# EAGLE design D1 Breakout - LCD TH Screws (EAGLE 7.3.0)
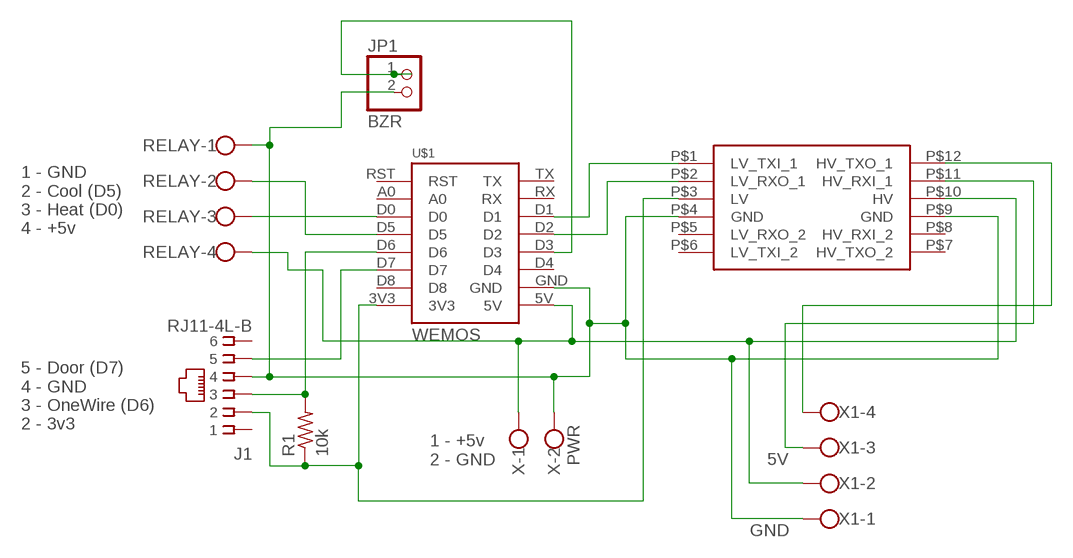
[diagram p0: schematic, sheet 1]

## Parts
J1  RJ11-4L-B  [RJ11-NO_SHIELD]
JP1  BZR  PINHD-1X2  [1X02]
R1  10k  R-US_0207/5V  [0207/5V]
RELAY  W237-4  [W237-4]
U$1  WEMOS  [WEMOS]
U$3  LOGIC_LEVEL_CONVERTER  [LOGIC_LEVEL_CONVERTER]
X  PWR  W237-102  [W237-102]
X1  W237-4  [W237-4]

## Nets
5V [5v]: RELAY.4 U$1.5V U$3.P$10(HV) X1.2 X.1
D0: RELAY.3 U$1.D0
D5: RELAY.2 U$1.D5
D6: J1.3 R1.2 U$1.D6
D7: J1.5 U$1.D7
GND [Gnd]: J1.4 JP1.2 RELAY.1 U$1.GND U$3.P$4(GND) U$3.P$9(GND) X1.1 X.2
N$1: U$1.D1 U$3.P$1(LV_TXI_1)
N$2: U$1.D2 U$3.P$2(LV_RXO_1)
N$3 [3v]: J1.2 R1.1 U$1.3V3 U$3.P$3(LV)
N$4: U$3.P$12(HV_TXO_1) X1.4
N$5: U$3.P$11(HV_RXI_1) X1.3
N$6: JP1.1 U$1.D3
Unconnected: J1.1 J1.6 U$1.A0 U$1.D4 U$1.D8 U$1.RST U$1.RX U$1.TX U$3.P$5(LV_RXO_2) U$3.P$6(LV_TXI_2) U$3.P$7(HV_TXO_2) U$3.P$8(HV_RXI_2)

## Notes on the sheet
- 1 - GND
  2 - Cool (D5)
  3 - Heat (D0)
  4 - +5v
- 5 - Door (D7)
  4 - GND
  3 - OneWire (D6) 
  2 - 3v3
- 1 - +5v
  2 - GND

## Library data of the parts
J1 = con-tycoelectronics:RJ11: CORCOM Modular RJ Jacks No Shield Source: www.tycoelectronics.com .. ENG_DS_1654001_1099_RJ_L_0507.pdf; MF: TYCO ELECTRONICS; MPN: RJ11-4L-B; OC_FARNELL: unknown; OC_NEWARK: 52K3315
JP1 = pinhead:PINHD-1X2: PIN HEADER
R1 = rcl:R-US_: RESISTOR, American symbol
RELAY X1 = con-wago-500:W237-4: WAGO SCREW CLAMP; OC_FARNELL: unknown; OC_NEWARK: unknown
U$1 = 1455413453956-wemos:WEMOS
U$3 = SparkFun-Boards:LOGIC_LEVEL_CONVERTER: Logic Level Converter (3.3v - 5v) https://www.sparkfun.com/products/8745
X = con-wago-500:W237-102: WAGO SCREW CLAMP; MPN: 237-102; OC_FARNELL: unknown; OC_NEWARK: 70K9898

## Net classes
0 default: width 0.305 mm, clearance 0.305 mm
1 5v: width 0.406 mm, clearance 0.406 mm
2 3v: width 0.406 mm, clearance 0.406 mm
3 Gnd: width 0.406 mm, clearance 0.406 mm

## Board
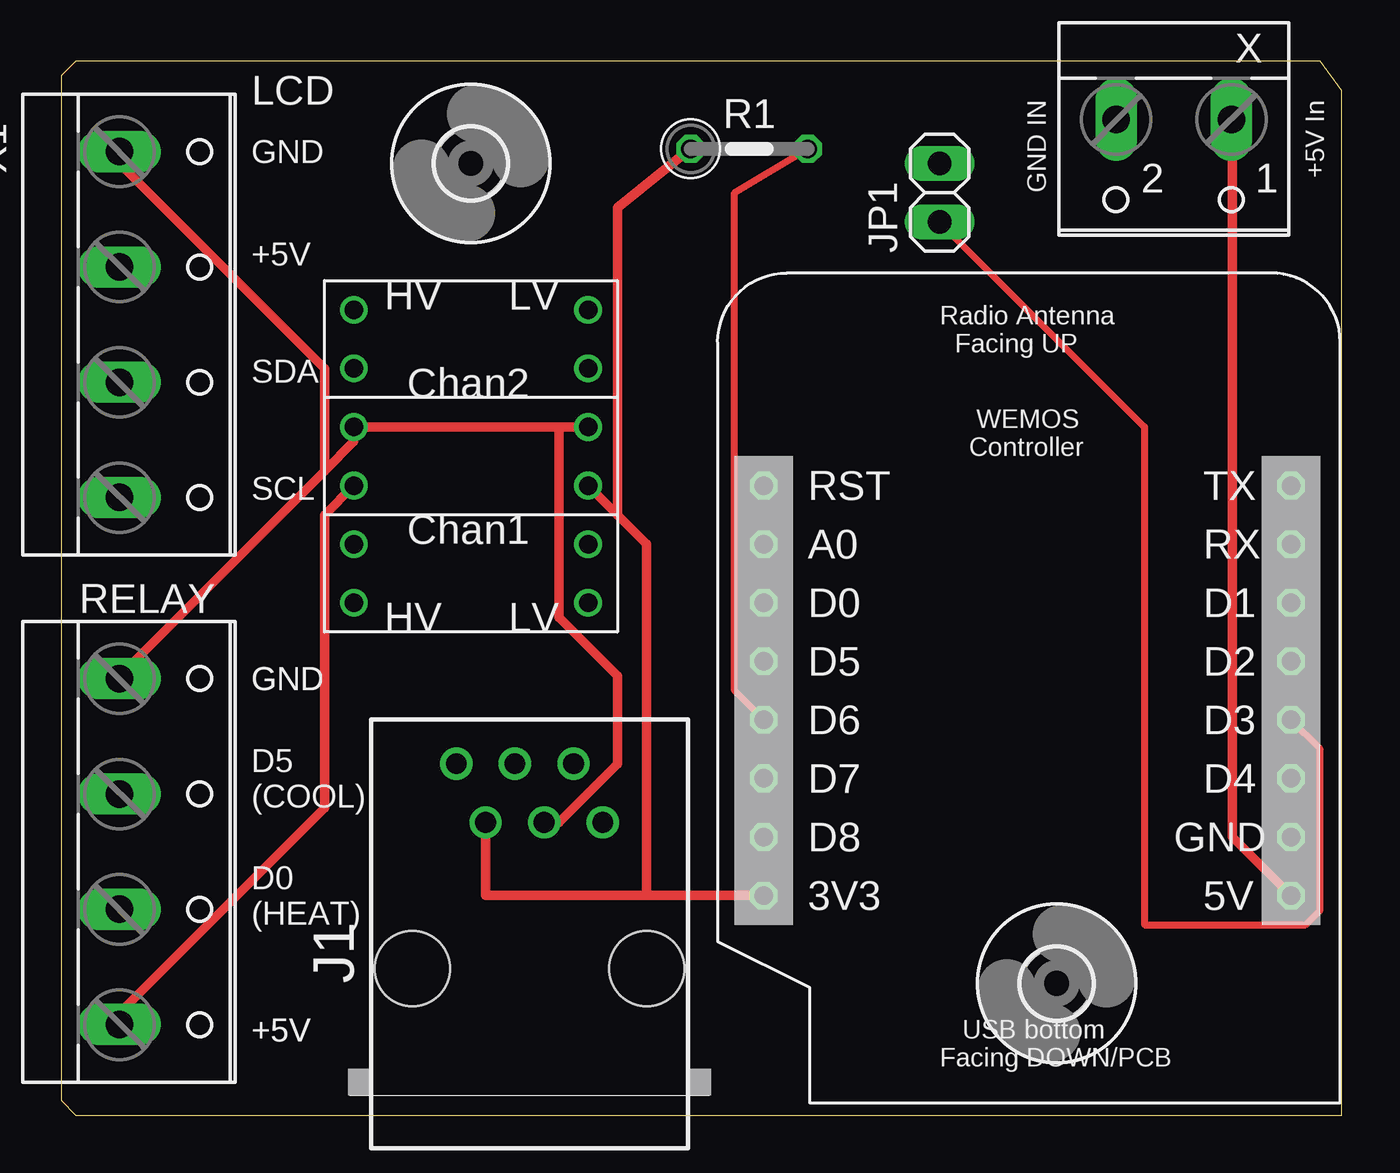
[diagram p1: board, top side]
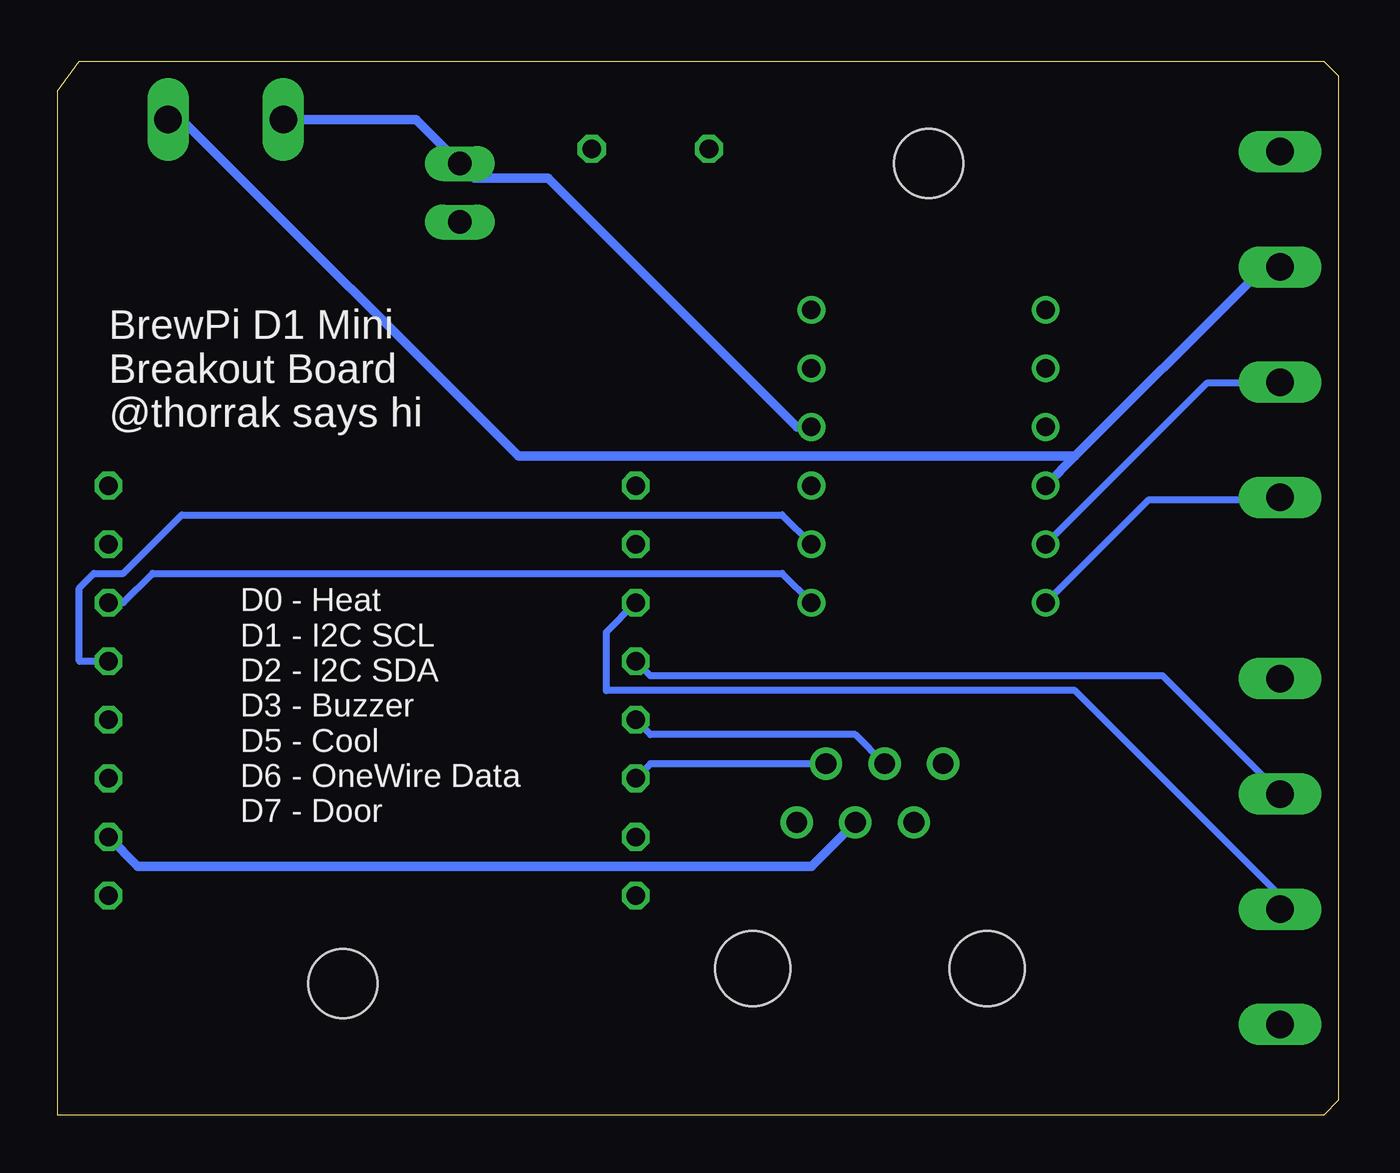
[diagram p2: board, bottom side, seen from below]

Size 55.55 x 45.72 mm. Coordinates in mm from the lower left corner, seen from the top.
Outline: 0,0.64 0.63,0 55.55,0 55.55,44.44 54.61,45.71 53.34,45.72 0.63,45.72 0,45.08 0,0.64
Copper layers (1*16): Top 0.0356mm / dielectric 1.5011mm / Bottom 0.0356mm
Design rules "PCBs_io": minimum track width 6mil, minimum drill 13mil, track to track 6mil, track to pad 6mil, pad to pad 6mil, via to via 6mil, smd to smd 6mil, copper to edge 15mil, drill to drill 6mil, minimum pad ring 7mil, minimum via ring 7mil, stop-mask expansion 3mil, vias tented up to drill 0mil, thermal gap 10mil

### Footprints (pad centres in the part's own frame; a part is rotated, then mirrored left to right if it is on the bottom)
RJ11-NO_SHIELD = drill 0.9 pad 1.4: 1 -3.175,8.89; 2 -1.905,6.35; 3 -0.635,8.89; 4 0.635,6.35; 5 1.905,8.89; 6 3.175,6.35 | hole 3.251: -5.08,0; 5.08,0
1X02 = drill 1.016 long: 1 -1.27,0; 2 1.27,0
0207/5V = drill 0.813 octagon: 1 -2.54,0; 2 2.54,0
W237-4 = drill 1.194 long: 1 -7.5,-1.27; 2 -2.5,-1.27; 3 2.5,-1.27; 4 7.5,-1.27
WEMOS = drill 0.8 octagon: 3V3 0,0; 5V 22.86,0; A0 0,15.24; D0 0,12.7; D1 22.86,12.7; D2 22.86,10.16; D3 22.86,7.62; D4 22.86,5.08; D5 0,10.16; D6 0,7.62; D7 0,5.08; D8 0,2.54; GND 22.86,2.54; RST 0,17.78; RX 22.86,15.24; TX 22.86,17.78
3,0 = hole 3: 0,0
LOGIC_LEVEL_CONVERTER = drill 0.8: P$1 1.27,13.97; P$2 1.27,11.43; P$3 1.27,8.89; P$4 1.27,6.35; P$5 1.27,3.81; P$6 1.27,1.27; P$7 11.43,1.27; P$8 11.43,3.81; P$9 11.43,6.35; P$10 11.43,8.89; P$11 11.43,11.43; P$12 11.43,13.97
W237-102 = drill 1.194 long: 1 -2.5,-1.27; 2 2.5,-1.27

### Placement (x,y rotation side)
J1  20.32,6.35 0 top
JP1  38.1,40 90 top
R1  29.84,41.91 0 top
RELAY  3.81,11.43 270 top
U$1  30.48,9.53 0 top
U$2  [3,0]  17.78,41.27 0 top
U$3  24.13,36.19 180 top
U$4  [3,0]  43.18,5.71 0 top
X  48.26,41.91 180 top
X1  3.81,34.29 270 top

### Tracks (layer width: path | path; a pad name or v marks a point on that pad's centre or on a via)
5V
  Top 0.406: U$1.5V 50.8,12.07 50.8,43.18 X.1 | U$3.P$10 11.43,26.04 11.43,13.33 2.54,4.45 RELAY.4
  Bottom 0.406: 11.43,28.57 3.81,36.19 2.54,36.19 X1.2 | 11.43,28.57 U$3.P$10 | 11.43,28.57 35.56,28.57 50.17,43.18 X.1
D0
  Bottom 0.305: U$1.D0 31.75,20.96 31.75,18.42 11.43,18.42 2.54,9.53 RELAY.3
D5
  Bottom 0.305: U$1.D5 29.84,19.05 7.62,19.05 2.54,13.97 RELAY.2
D6
  Top 0.305: R1.2 29.21,40 29.21,18.42 U$1.D6
  Bottom 0.305: U$1.D6 29.84,16.51 20.96,16.51 J1.3
D7
  Bottom 0.305: U$1.D7 29.84,15.24 J1.5
GND
  Top 0.406: U$3.P$4 21.59,29.85 | 21.59,29.85 U$3.P$9 12.7,29.21 11.43,27.94 | 11.43,27.94 2.54,19.05 RELAY.1 | 11.43,27.94 11.43,32.39 2.54,41.27 X1.1 | J1.4 21.59,12.7 24.13,15.24 24.13,19.05 21.59,21.59 21.59,29.85
  Bottom 0.406: U$1.GND 52.07,10.79 22.86,10.79 J1.4 | X.2 40,43.18 JP1.2 37.47,40.64 34.29,40.64 23.5,29.85 U$3.P$4
N$1
  Bottom 0.305: U$3.P$1 24.13,23.5 51.44,23.5 52.7,22.22 U$1.D1
N$2
  Bottom 0.305: U$3.P$2 24.13,26.04 50.17,26.04 52.7,23.5 53.98,23.5 54.61,22.86 54.61,19.68 U$1.D2
N$3
  Top 0.406: 25.4,9.53 18.41,9.53 J1.2 | 25.4,9.53 U$1.3V3 | 24.13,26.04 25.4,24.77 25.4,9.53 | 24.13,26.04 U$3.P$3 | R1.1 24.13,39.37 24.13,26.04
N$4
  Bottom 0.305: U$3.P$12 8.25,26.67 2.54,26.67 X1.4
N$5
  Bottom 0.305: U$3.P$11 5.71,31.75 2.54,31.75 X1.3
N$6
  Top 0.305: U$1.D3 54.61,15.88 54.61,8.89 53.98,8.25 46.99,8.25 46.99,29.85 JP1.1

### Text on the board
tPlace: GND | GND IN | +5V In | +5V | SDA | SCL | GND | GND | D5 / (COOL) | D0 / (HEAT) | +5V | +5V
tNames: LCD
bNames: BrewPi D1 Mini / Breakout Board / @thorrak says hi | D0 - Heat / D1 - I2C SCL / D2 - I2C SDA / D3 - Buzzer / D5 - Cool / D6 - OneWire Data / D7 - Door